# EAGLE design Sensor Board (EAGLE 7.5.0)
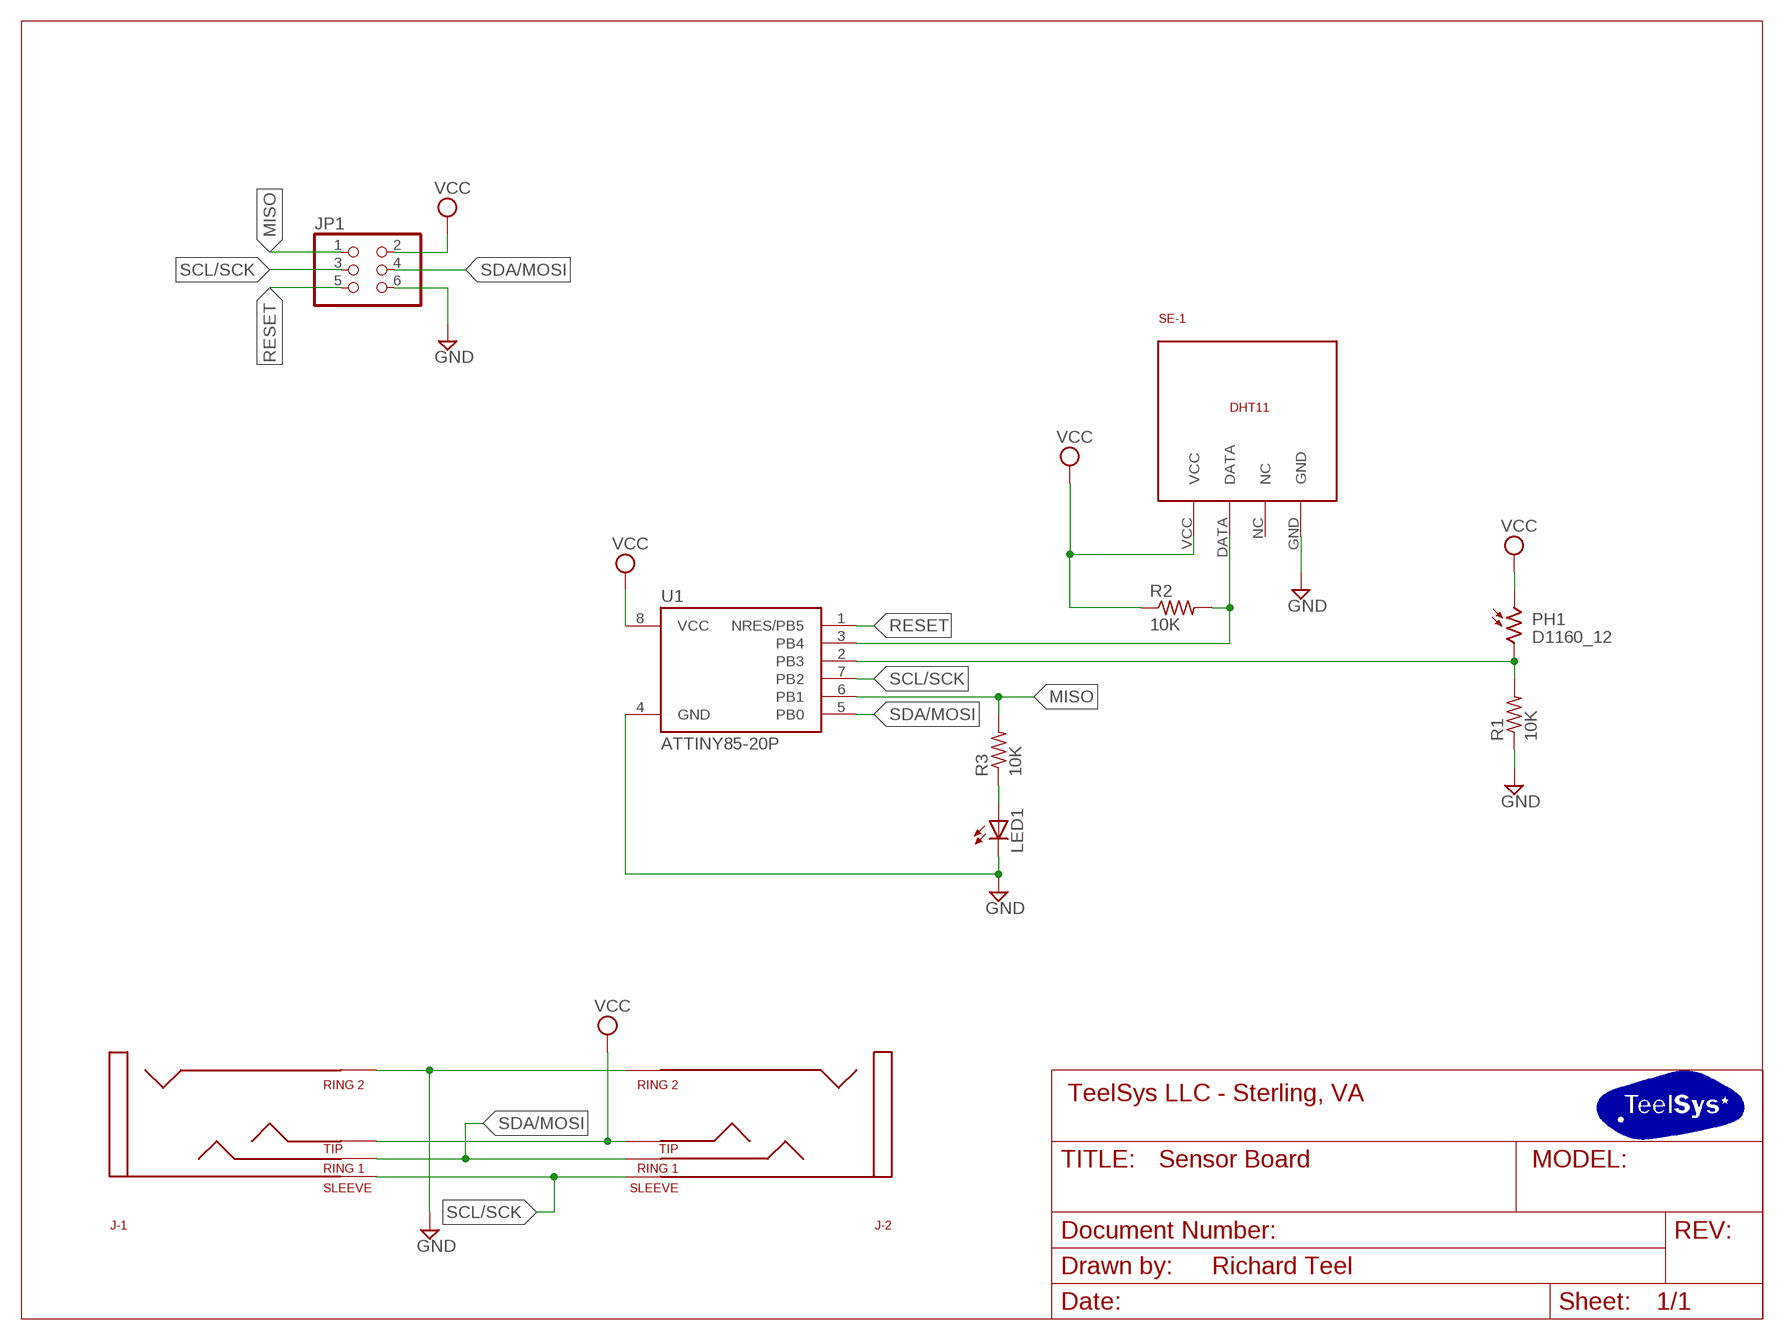
[diagram p0: schematic, sheet 1]
FRAME1 (LETTER_L): COMPANY_INFO: TeelSys LLC - Sterling, VA; DRAWN_BY: Richard Teel

## Parts
J-1  4POLE_AUDIO_JACK  [4POLE_AUDIO_JACK]
J-2  4POLE_AUDIO_JACK  [4POLE_AUDIO_JACK]
JP1  PINHD-2X3  [2X03]
LED1  LED5MM  [LED5MM]
PH1  D1160_12  [D11XX]
R1  10K  R-US_FLIPFLOP  [0805-THM]
R2  10K  R-US_FLIPFLOP  [0805-THM]
R3  10K  R-US_FLIPFLOP  [0805-THM]
SE-1  DHT11THROUGH_HOLE  [DHT11]
U1  ATTINY85-20P  [PDIP08_300MIL]

## Nets
GND: J-1.RING2 J-2.RING2 JP1.6 LED1.K(C) R1.1 SE-1.GND U1.4(GND)
MISO: JP1.1 R3.2 U1.6(PB1)
N$1: PH1.2 R1.2 U1.2(PB3)
N$2: R2.2 SE-1.DATA U1.3(PB4)
N$3: LED1.A R3.1
RESET: JP1.5 U1.1(NRES/PB5)
SCL/SCK: J-1.SLEEVE J-2.SLEEVE JP1.3 U1.7(PB2)
SDA/MOSI: J-1.RING1 J-2.RING1 JP1.4 U1.5(PB0)
VCC: J-1.TIP1(TIP) J-2.TIP1(TIP) JP1.2 PH1.1 R2.1 SE-1.VCC U1.8(VCC)
Unconnected: SE-1.NC

## Library data of the parts
J-1 J-2 = teelsys-0.2:4POLE_AUDIO_JACK
JP1 = pinhead:PINHD-2X3: PIN HEADER
LED1 = adafruit:LED: LED OSRAM: - CHIPLED LG R971, LG N971, LY N971, LG Q971, LY Q971, LO R971, LY R971 LH N974, LH R974 LS Q976, LO Q976, LY Q976 LO Q996 - Hyper CHIPLED LW Q18S LB Q993, LB Q99A, LB R99A - SideLED LS A670, LO A670, LY A670, LG A670, LP A670 LB A673, LV A673, LT A673, LW A673 LH A674 LY A675 LS A676, LA A676, LO A676, LY A676, LW A676 LS A679, LY A679, LG A679 - Hyper Micro SIDELED® LS Y876, LA Y876, LO Y876, LY Y876 LT Y87S - SmartLED LW L88C, LW L88S LB L89C, LB L89S, LG L890 LS L89K, LO L89K, LY L89K LS L896, LA L896, LO L896, LY L896 - TOPLED LS T670, LO T670, LY T670, LG T670, LP T670 LSG T670, LSP T670, LSY T670, LOP T670, LYG T670 LG T671, LOG T671, LSG T671 LB T673, LV T673, LT T673, LW T673 LH T674 LS T676, LA T676, LO T676, LY T676, LB T676, LH T676, LSB T676, LW T676 LB T67C, LV T67C, LT T67C, LS T67K, LO T67K, LY T67K, LW E67C LS E67B, LA E67B, LO E67B, LY E67B, LB E67C, LV E67C, LT E67C LW T67C LS T679, LY T679, LG T679 LS T770, LO T770, LY T770, LG T770, LP T770 LB T773, LV T773, LT T773, LW T773 LH T774 LS E675, LA E675, LY E675, LS T675 LS T776, LA T776, LO T776, LY T776, LB T776 LHGB T686 LT T68C, LB T68C - Hyper Mini TOPLED® LB M676 - Mini TOPLED Santana® LG M470 LS M47K, LO M47K, LY M47K Source: http://www.osram.convergy.de/
PH1 = photo-elements:D11: Photo Sensor Oil Burner Control Applications Source: http://optoelectronics.perkinelmer.com/content/Datasheets/DTS_PhotocellsD1160.pdf
R1-R3 = adafruit:R-US_: RESISTOR, American symbol
SE-1 = teelsys-0.2:DHT11
U1 = attiny25_45_85:ATTINY85*: ATMEL ATtiny 85 Packages: P = PDIP 08 30mil S = SOIC 08 EIAJ 208mil Technologies Note: for complete ordering code (temp. range, finish, tape&reel etc.) see www.atmel.com • Supply Voltage: V = (1.8…5.5)V | [blank] = (2.7…5.5)V • Speed: 10 = 10 MHz | 20 = 20 MHz Author: Dipl.-Ing. FH Rainer Bayer HHN Hochschule Heilbronn (Heilbronn University), rainer.bayer@hs-heilbronn.de Ingenieurbüro ing-rb, mail@ing-rb.de

## Board
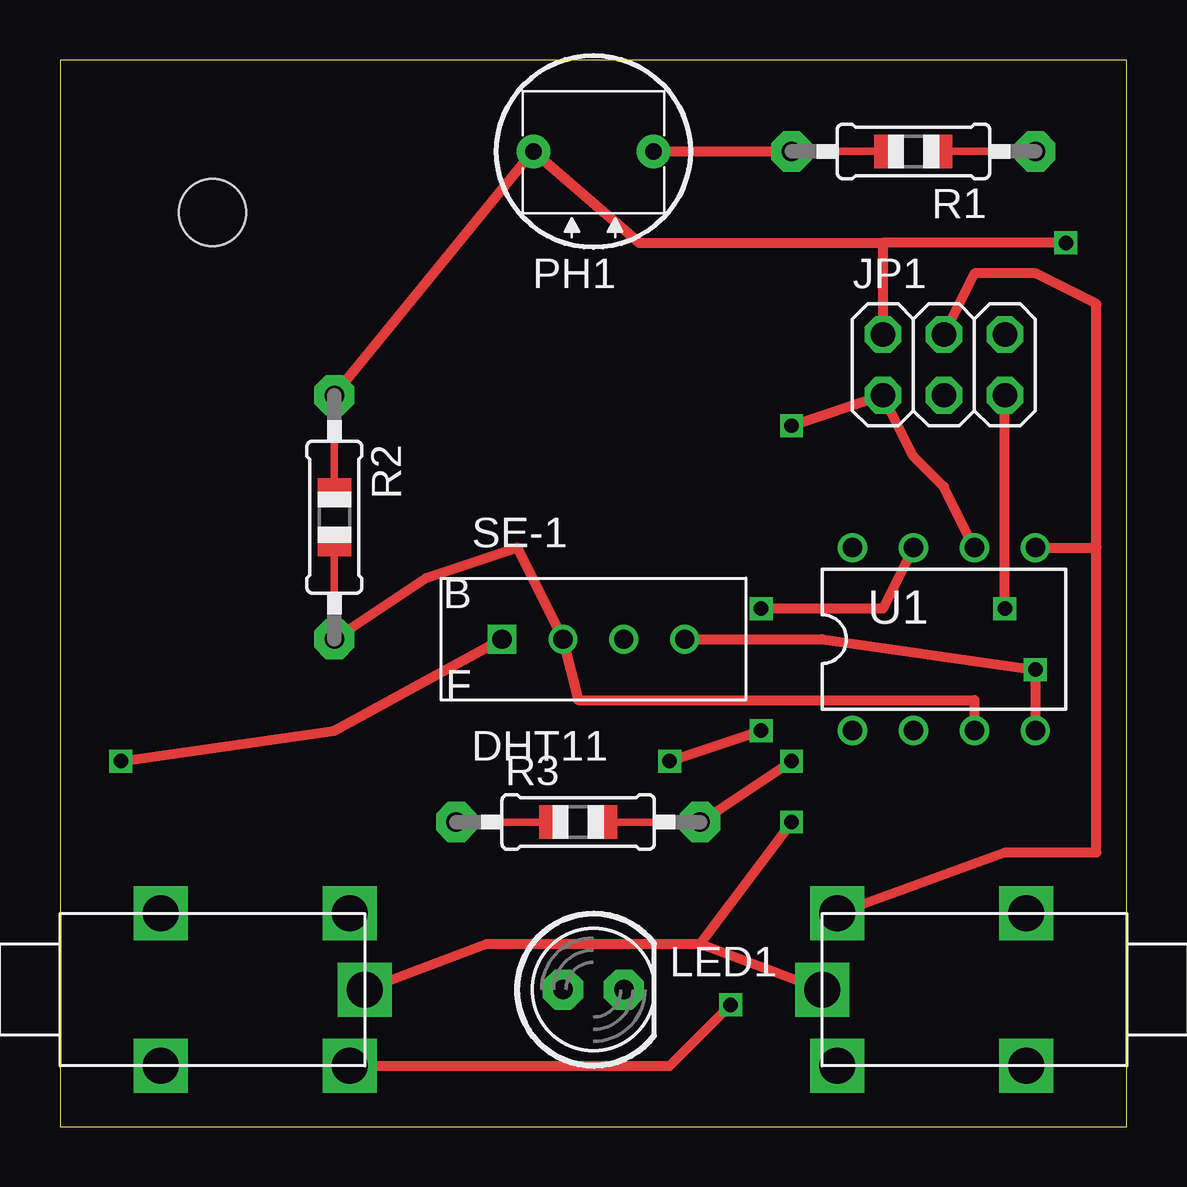
[diagram p1: board, top side]
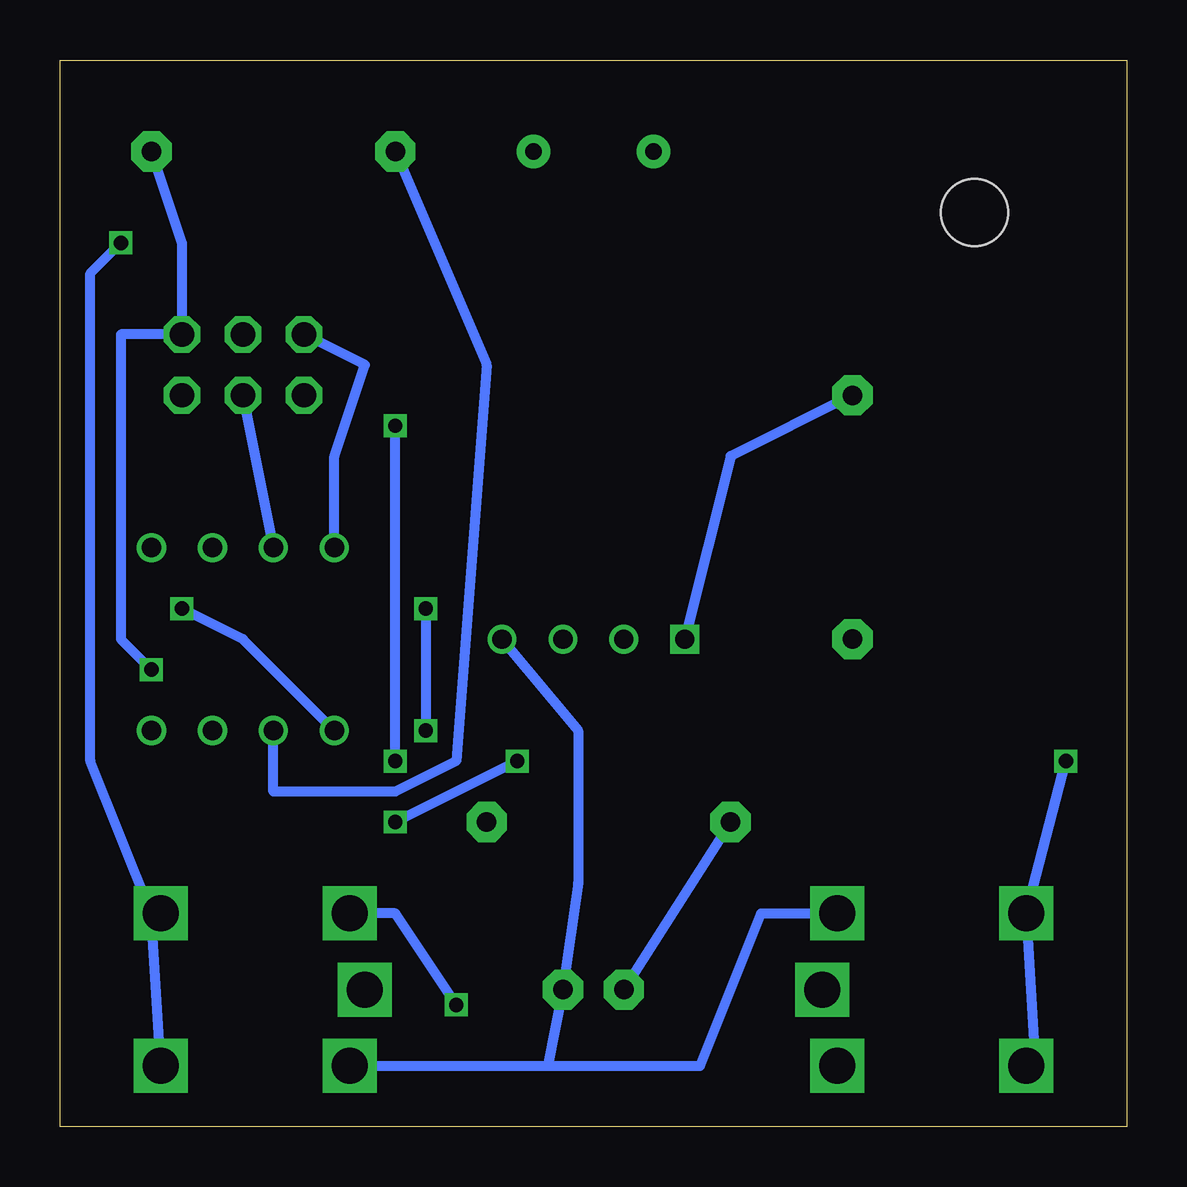
[diagram p2: board, bottom side, seen from below]

Size 44.45 x 44.45 mm. Coordinates in mm from the lower left corner, seen from the top.
Outline: 0,0 44.45,0 44.45,44.45 0,44.45 0,0
Copper layers (1*16): Top 0.0356mm / dielectric 1.5011mm / Bottom 0.0356mm
Design rules "LaenPCBOrder": minimum track width 6mil, minimum drill 13mil, track to track 6mil, track to pad 6mil, pad to pad 6mil, via to via 6mil, smd to smd 6mil, copper to edge 15mil, drill to drill 6mil, minimum pad ring 7mil, minimum via ring 7mil, stop-mask expansion 3mil, vias tented up to drill 0mil, thermal gap 10mil
Holes 2.8 mm at 6.35,38.1

### Footprints (pad centres in the part's own frame; a part is rotated, then mirrored left to right if it is on the bottom)
4POLE_AUDIO_JACK = drill 1.5 square: RING1 12.065,0; RING2 12.065,6.35; SLEEVE 12.7,3.175; TIP1 4.191,6.35; TIP2 4.191,0
2X03 = drill 1.016 octagon: 1 -2.54,-1.27; 2 -2.54,1.27; 3 0,-1.27; 4 0,1.27; 5 2.54,-1.27; 6 2.54,1.27
LED5MM = drill 0.813 pad 1.676 octagon: A -1.27,0; K 1.27,0
D11XX = drill 0.7 pad 1.4: 1 -2.5,0; 2 2.5,0
0805-THM = drill 0.813 pad 1.676 octagon: 1 -5.08,0; 2 5.08,0
DHT11 = drill 0.8: DATA -1.27,0; GND 3.81,0; NC 1.27,0 | drill 0.8 square: VCC -3.81,0
PDIP08_300MIL = drill 0.813: 1 -3.81,-3.81; 2 -1.27,-3.81; 3 1.27,-3.81; 4 3.81,-3.81; 5 3.81,3.81; 6 1.27,3.81; 7 -1.27,3.81; 8 -3.81,3.81

### Placement (x,y rotation side)
J-1  0,2.54 0 top
J-2  44.45,8.89 180 top
JP1  36.83,31.75 0 top
LED1  22.23,5.71 0 top
PH1  22.23,40.64 0 top
R1  35.56,40.64 180 top
R2  11.43,25.4 270 top
R3  21.59,12.7 0 top
SE-1  22.23,20.32 0 top
U1  36.83,20.32 0 top

### Tracks (layer width: path | path; a pad name or v marks a point on that pad's centre or on a via)
GND  (via drill 0.6)
  Top 0.406: SE-1.GND 31.75,20.32 v40.64,19.05 U1.4
  Bottom 0.406: SE-1.GND 22.86,16.51 22.86,10.16 LED1.K 24.13,2.54 | J-2.RING2 24.13,2.54 | 24.13,2.54 17.78,2.54 15.24,8.89 J-1.RING2 | R1.1 39.37,36.83 JP1.6 41.91,33.02 41.91,20.32 v40.64,19.05
MISO  (via drill 0.6)
  Top 0.406: U1.6 36.83,26.67 35.56,27.94 JP1.1 v30.48,29.21 | R3.2 v30.48,15.24
  Bottom 0.406: v30.48,15.24 v30.48,29.21
N$1
  Top 0.406: PH1.2 R1.2
  Bottom 0.406: R1.2 26.67,31.75 27.94,15.24 30.48,13.97 35.56,13.97 U1.2
N$2
  Top 0.406: R2.2 15.24,22.86 19.05,24.13 SE-1.DATA 21.59,17.78 38.1,17.78 U1.3
N$3
  Bottom 0.406: R3.1 LED1.A
RESET  (via drill 0.6)
  Top 0.406: v39.37,21.59 JP1.5
  Bottom 0.406: U1.1 36.83,20.32 v39.37,21.59
SCL/SCK  (via drill 0.6)
  Top 0.406: J-1.SLEEVE 17.78,7.62 26.67,7.62 | 26.67,7.62 J-2.SLEEVE | U1.7 34.29,21.59 v29.21,21.59 | v29.21,16.51 v25.4,15.24 | v30.48,12.7 26.67,7.62
  Bottom 0.406: JP1.3 U1.7 | v29.21,21.59 v29.21,16.51 | v25.4,15.24 v30.48,12.7
SDA/MOSI  (via drill 0.6)
  Top 0.406: J-1.RING1 25.4,2.54 v27.94,5.08 | J-2.RING1 39.37,11.43 43.18,11.43 43.18,24.13 | U1.5 43.18,24.13 | 43.18,24.13 43.18,34.29 40.64,35.56 38.1,35.56 JP1.4
  Bottom 0.406: v27.94,5.08 30.48,8.89 J-2.RING1
VCC  (via drill 0.6)
  Top 0.406: v41.91,36.83 34.29,36.83 | 34.29,36.83 JP1.2 | v2.54,15.24 11.43,16.51 SE-1.VCC | R2.1 PH1.1 24.13,36.83 34.29,36.83
  Bottom 0.406: 3.81,2.54 J-1.TIP1 v2.54,15.24 | J-2.TIP1 40.64,8.89 43.18,15.24 43.18,35.56 v41.91,36.83 | R2.1 16.51,27.94 SE-1.VCC | U1.8 33.02,27.94 31.75,31.75 JP1.2